# EAGLE design RBPZ_DynamixelMaxim (EAGLE 9.6.2)
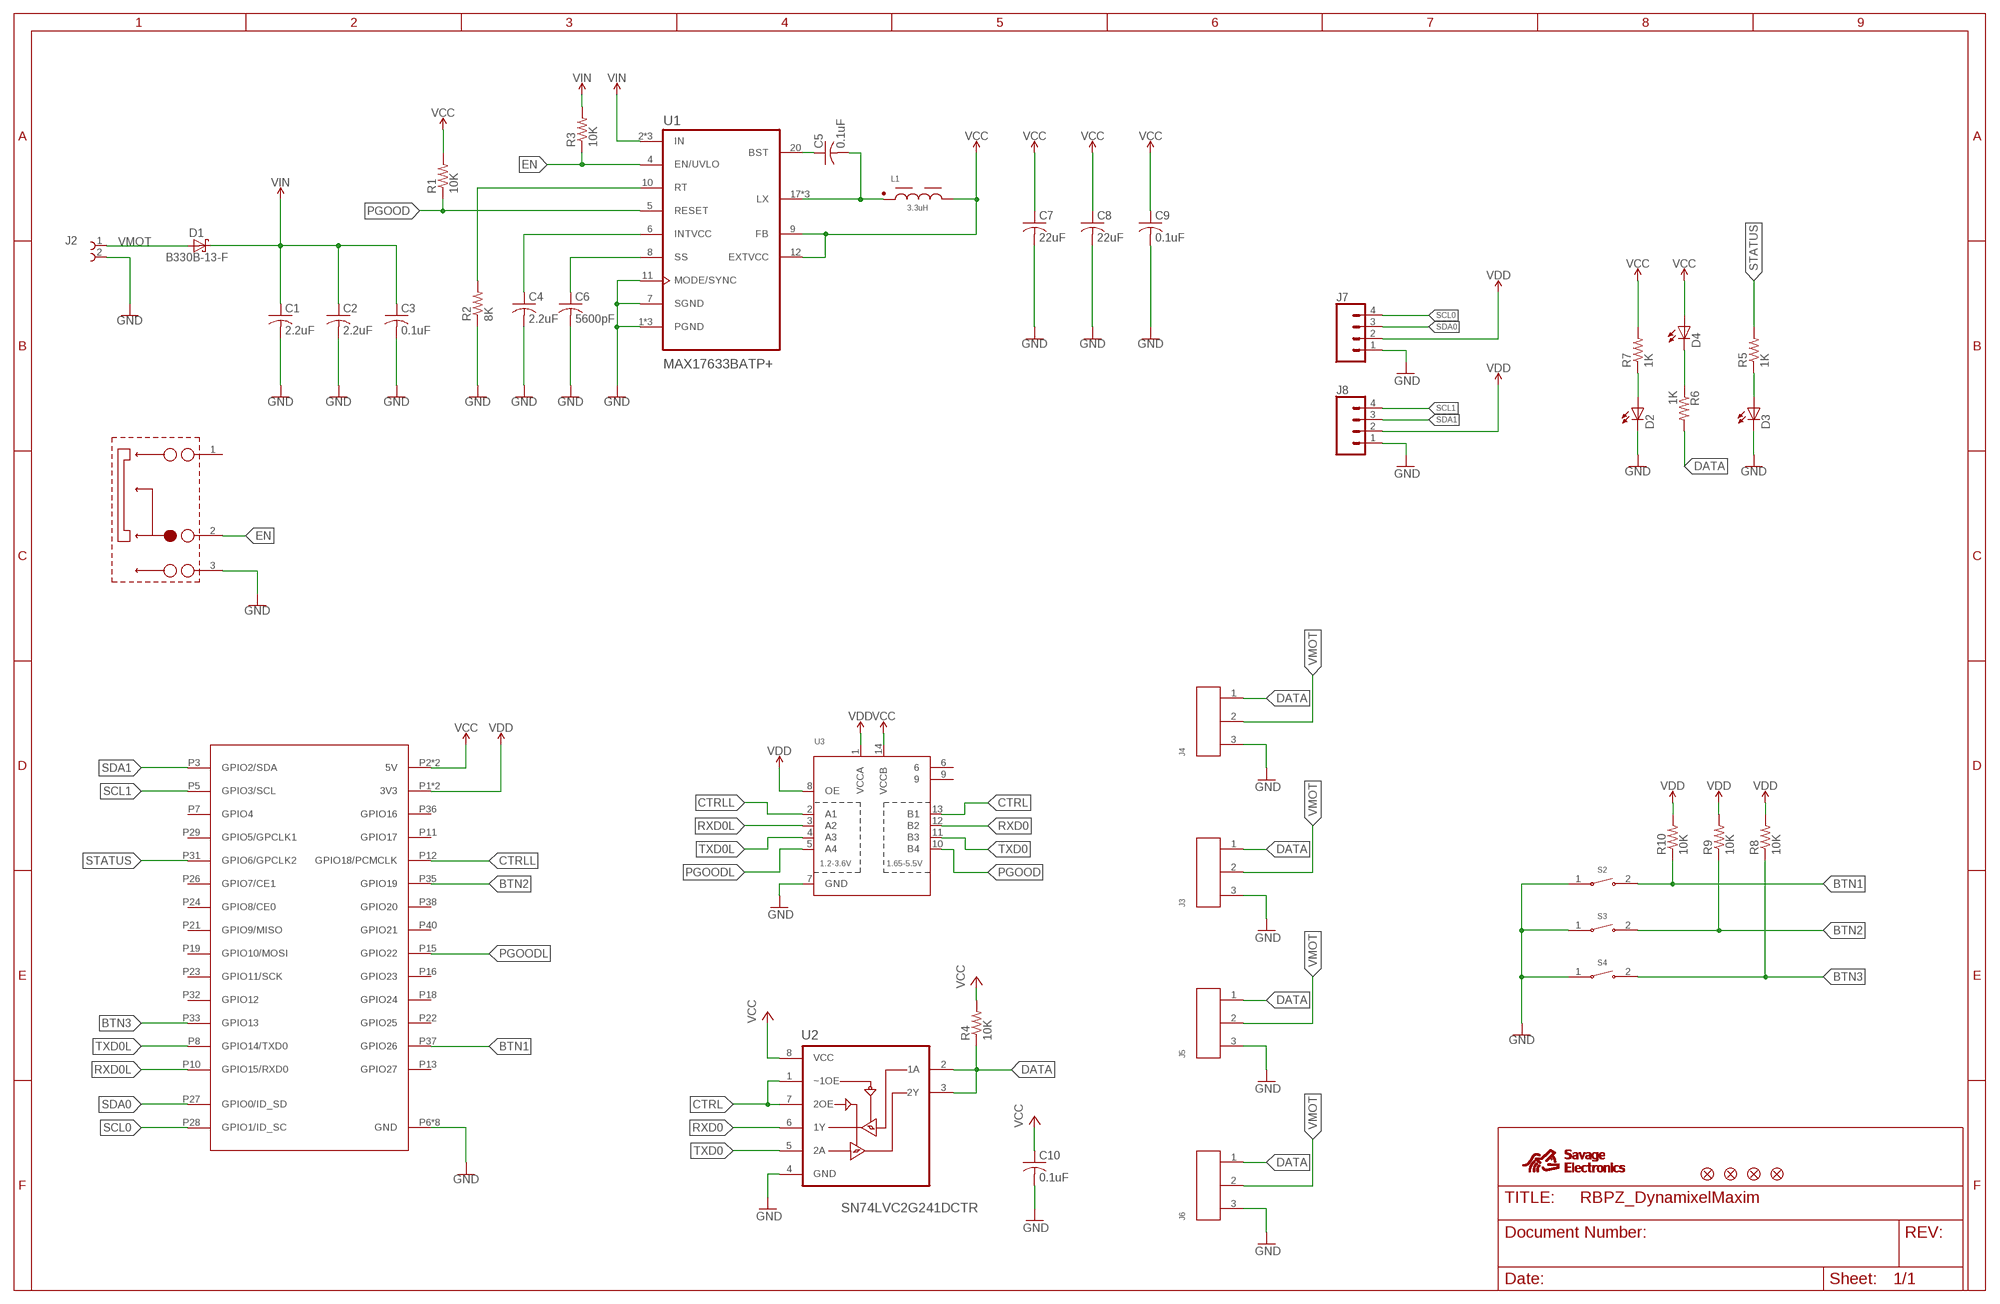
[diagram p0: schematic, sheet 1]

## Parts
C1  2.2uF  C-USC1210  [C1210]
C2  2.2uF  C-USC1210  [C1210]
C3  0.1uF  C-USC0805  [C0805]
C4  2.2uF  C-USC1206  [C1206]
C5  0.1uF  C-USC0603  [C0603]
C6  5600pF  C-USC0805  [C0805]
C7  22uF  C-USC1210  [C1210]
C8  22uF  C-USC1210  [C1210]
C9  0.1uF  C-USC0805  [C0805]
C10  0.1uF  C-USC0603  [C0603]
D1  B330B-13-F  [DIONM4336X250N]
D2  LEDCHIP-LED0805  [CHIP-LED0805]
D3  LEDCHIP-LED0805  [CHIP-LED0805]
D4  LEDCHIP-LED0805  [CHIP-LED0805]
FID1  FIDUCIAL""  [FIDUCIAL_1MM]
FID2  FIDUCIAL""  [FIDUCIAL_1MM]
FID3  FIDUCIAL""  [FIDUCIAL_1MM]
FID4  FIDUCIAL""  [FIDUCIAL_1MM]
J1  RBPZERO  [61004021821_RASPBERRYPIZERO]
J2  691137910002  [691137910002]
J3  64600311622  [64600311622]
J4  64600311622  [64600311622]
J5  64600311622  [64600311622]
J6  64600311622  [64600311622]
J7  CONN_04SMD2  [1X04_1MM_RA]
J8  CONN_04SMD2  [1X04_1MM_RA]
L1  3.3uH  WE-SPC_4828_74408942012  [WE-SPC_48XX]
R1  10K  R-US_R0805  [R0805]
R2  8K  R-US_R0805  [R0805]
R3  10K  R-US_R0805  [R0805]
R4  10K  R-US_R0805  [R0805]
R5  1K  R-US_R0805  [R0805]
R6  1K  R-US_R0805  [R0805]
R7  1K  R-US_R0805  [R0805]
R8  10K  R-US_R0805  [R0805]
R9  10K  R-US_R0805  [R0805]
R10  10K  R-US_R0805  [R0805]
S1  450404015514  [450404015514]
S2  434123025826-2PIN  [434123025826-2PIN]
S3  434123025826-2PIN  [434123025826-2PIN]
S4  434123025826-2PIN  [434123025826-2PIN]
U1  MAX17633BATP+  [QFN50P400X400X80-21N]
U2  SN74LVC2G241DCTR  SN74LVC2G241  [SOP65P400X130-8N]
U3  TXB0104PWR  [TSSOP14]

## Nets
BTN1: J1.P37(GPIO26) R10.1 S2.2
BTN2: J1.P35(GPIO19) R9.1 S3.2
BTN3: J1.P33(GPIO13) R8.1 S4.2
CTRL: U2.1(~1OE) U2.7(2OE) U3.13(B1)
CTRLL: J1.P12(GPIO18/PCMCLK) U3.2(A1)
DATA: J3.1 J4.1 J5.1 J6.1 R4.1 R6.2 U2.2(1A) U2.3(2Y)
EN: R3.1 S1.2 U1.4(EN/UVLO)
GND: C1.2 C2.2 C3.2 C4.2 C6.2 C7.2 C8.2 C9.2 C10.2 D2.C D3.C J1.P6(GND) J1.P9(GND) J1.P14(GND) J1.P20(GND) J1.P25(GND) J1.P30(GND) J1.P34(GND) J1.P39(GND) J2.2 J3.3 J4.3 J5.3 J6.3 J7.1 J8.1 R2.1 S1.3 S2.1 S3.1 S4.1 U1.1(PGND) U1.7(SGND) U1.11(MODE/SYNC) U1.15(PGND) U1.21(PGND) U2.4(GND) U3.7(GND)
N$1: D4.C R6.1
N$2: C6.1 U1.8(SS)
N$3: D2.A R7.1
N$4: C5.2 L1.1 U1.17(LX) U1.18(LX) U1.19(LX)
N$5: D3.A R5.1
N$6: R2.2 U1.10(RT)
N$7: C5.1 U1.20(BST)
N$8: C4.1 U1.6(INTVCC)
PGOOD: R1.1 U1.5(RESET) U3.10(B4)
PGOODL: J1.P15(GPIO22) U3.5(A4)
RXD0: U2.6(1Y) U3.12(B2)
RXD0L: J1.P10(GPIO15/RXD0) U3.3(A2)
SCL0: J1.P28(GPIO1/ID_SC) J7.4
SCL1: J1.P5(GPIO3/SCL) J8.4
SDA0: J1.P27(GPIO0/ID_SD) J7.3
SDA1: J1.P3(GPIO2/SDA) J8.3
STATUS: J1.P31(GPIO6/GPCLK2) R5.2
TXD0: U2.5(2A) U3.11(B3)
TXD0L: J1.P8(GPIO14/TXD0) U3.4(A3)
VCC: C7.1 C8.1 C9.1 C10.1 D4.A J1.P2(5V) J1.P4(5V) L1.2 R1.2 R4.2 R7.2 U1.9(FB) U1.12(EXTVCC) U2.8(VCC) U3.14(VCCB)
VDD: J1.P1(3V3) J1.P17(3V3) J7.2 J8.2 R8.2 R9.2 R10.2 U3.1(VCCA) U3.8(OE)
VIN: C1.1 C2.1 C3.1 D1.1(C) R3.2 U1.2(IN) U1.3(IN) U1.14(IN)
VMOT: D1.2(A) J2.1 J3.2 J4.2 J5.2 J6.2
Unconnected: J1.P7(GPIO4) J1.P11(GPIO17) J1.P13(GPIO27) J1.P16(GPIO23) J1.P18(GPIO24) J1.P19(GPIO10/MOSI) J1.P21(GPIO9/MISO) J1.P22(GPIO25) J1.P23(GPIO11/SCK) J1.P24(GPIO8/CE0) J1.P26(GPIO7/CE1) J1.P29(GPIO5/GPCLK1) J1.P32(GPIO12) J1.P36(GPIO16) J1.P38(GPIO20) J1.P40(GPIO21) S1.1 U3.6 U3.9

## Library data of the parts
C1-C10 = Adafruit:C-US: CAPACITOR, American symbol
D1 = B330B-13-F:B330B-13-F: Schottky Diode
D2-D4 = Adafruit:LED: LED OSRAM: - CHIPLED LG R971, LG N971, LY N971, LG Q971, LY Q971, LO R971, LY R971 LH N974, LH R974 LS Q976, LO Q976, LY Q976 LO Q996 - Hyper CHIPLED LW Q18S LB Q993, LB Q99A, LB R99A - SideLED LS A670, LO A670, LY A670, LG A670, LP A670 LB A673, LV A673, LT A673, LW A673 LH A674 LY A675 LS A676, LA A676, LO A676, LY A676, LW A676 LS A679, LY A679, LG A679 - Hyper Micro SIDELED® LS Y876, LA Y876, LO Y876, LY Y876 LT Y87S - SmartLED LW L88C, LW L88S LB L89C, LB L89S, LG L890 LS L89K, LO L89K, LY L89K LS L896, LA L896, LO L896, LY L896 - TOPLED LS T670, LO T670, LY T670, LG T670, LP T670 LSG T670, LSP T670, LSY T670, LOP T670, LYG T670 LG T671, LOG T671, LSG T671 LB T673, LV T673, LT T673, LW T673 LH T674 LS T676, LA T676, LO T676, LY T676, LB T676, LH T676, LSB T676, LW T676 LB T67C, LV T67C, LT T67C, LS T67K, LO T67K, LY T67K, LW E67C LS E67B, LA E67B, LO E67B, LY E67B, LB E67C, LV E67C, LT E67C LW T67C LS T679, LY T679, LG T679 LS T770, LO T770, LY T770, LG T770, LP T770 LB T773, LV T773, LT T773, LW T773 LH T774 LS E675, LA E675, LY E675, LS T675 LS T776, LA T776, LO T776, LY T776, LB T776 LHGB T686 LT T68C, LB T68C - Hyper Mini TOPLED® LB M676 - Mini TOPLED Santana® LG M470 LS M47K, LO M47K, LY M47K Source: http://www.osram.convergy.de/
FID1-FID4 = microbuilder:FIDUCIAL: Fiducial Alignment Points Various fiducial points for machine vision alignment.; BOM: EXCLUDE
J1 = RaspberryPi:RBPZERO
J2 = TerminalBlocks (rev19b):691137910002: WR-TBL1 SERIE 1379 - 7.50 MM - HORIZONTAL CABLE ENTRY WITH PRESSURE CLAMP - GLOW WIRE PLASTIC - 2 pins <http://katalog.we-online.de/media/thumbs2/eican/thb_Con-TBL_Screw_PressureClamp_6911379100xx_pf2.jpg> Details see: http://katalog.we-online.de/en/em/TBL_7_50_1379_HORIZONTAL_ENTRY_W_PRESSURE_CLAMP_69113791000x Created on 2015-07-09 2015 (C) Wurth Elektronik
J3-J6 = Wire-to-Board (rev18a):64600311622: WR-WTB 2.50mm Male Shrouded Header, 3 Pins=>Code : WR-WTB_Stiftleiste_m.V_64600311622 <http://katalog.we-online.de/media/thumbs2/eican/thb_WR-WTB_Stiftleiste_m.V_64600711622.jpg> Details see: http://katalog.we-online.de/en/em/WTB_2_50_MALE_SHROUDED_HEADER_6460XX11622 Created 2014-06-05, Karrer Zheng 2014 (C) Würth Elektronik
J7 J8 = SparkFun-Connectors:CONN_04: Multi connection point. Often used as Generic Header-pin footprint for 0.1 inch spaced/style header connections On any of the 0.1 inch spaced packages, you can populate with these: Break Away Headers - Straight <https://www.sparkfun.com/products/116> (PRT-00116) Break Away Male Headers - Right Angle <https://www.sparkfun.com/products/553> (PRT-00553) Female Headers <https://www.sparkfun.com/products/115> (PRT-00115) Break Away Headers - Machine Pin <https://www.sparkfun.com/products/117> (PRT-00117) Break Away Female Headers - Swiss Machine Pin <https://www.sparkfun.com/products/743> (PRT-00743) For SCREWTERMINALS and SPRING TERMINALS visit here: Screw Terimnals on SparkFun.com <https://www.sparkfun.com/search/results?term=Screw+Terminals> (5mm/3.5mm/2.54mm spacing) This device is also useful as a general connection point to wire up your design to another part of your project. Our various solder wires solder well into these plated through hole pads. Hook-Up Wire - Assortment (Stranded, 22 AWG) <https://www.sparkfun.com/products/11375> (PRT-11375) Hook-Up Wire - Assortment (Solid Core, 22 AWG) <https://www.sparkfun.com/products/11367> (PRT-11367) View the entire wire category on our website here <https://www.sparkfun.com/categories/141> Special notes: Molex polarized connector foot print use with SKU : PRT-08231 with associated crimp pins and housings. 1MM SMD Version SKU: PRT-10208; PROD_ID: CONN-10310; SF_ID: PRT-10208
L1 = EMCComponents (rev19b):WE-SPC_4828: SMD-Shielded Power Inductor WE-SPC <http://katalog.we-online.de/media/images/v2/Family_WE-SPC.jpg> Details see: http://katalog.we-online.de/en/pbs/WE-SPC? Updated by Dan Xu 2014-07-11 2014 (C) Würth Elektronik; WE-NUMBER: 74408942012/1,2uH
R1-R10 = Adafruit:R-US_: RESISTOR, American symbol
S1 = Eagle_SWITCHES (rev18c):450404015514: WS-SLSU Right angle Slide Switch with boss design Specification Rating 300mA, 12VDC Contact Resistance Initial:70mΩ max. After life test: 200mΩ max. Insulation Resistance: min.100MΩ at 500VDC Dielectric Strength : 250VAC for 1 minute Travel:1.5±0.15mm Operating force :150 ± 75g. Life cycle:10000 steps Switch function : ON-ON. Material Cover : : Stainless Steel Base :PA46 UL 94 HB,COLOR Black Frame :LCP UL 94 V-0, color Black Contact : :Copper Alloy with Silver Terminal : Copper Alloy with Silver <http://katalog.we-online.de/media/images/v2/Family_WS-SLSU_Gruppe.jpg> Details see: http://katalog.we-online.de/en/em/SLSU_6_7X_2_7_SMD_HORIZONTAL 2015 (C) Wurth Elektronik
S2-S4 = Eagle_SWITCHES (rev18c):434123025826-2PIN: 4.2 x 3.2 mm J-Bend SMD Tact Switch WS-TASV MATERIAL PROPERTIES: Cover Material Stainless Steel Actuator Material LCP Actuator Flammability Rating UL94 V-0 Actuator Color White;​ Black Frame Material LCP Frame Flammability Rating UL94 V-0 Frame Color Black Contact Material Stainless Steel Contact Plating Silver Terminal Material Copper Alloy Terminal Plating Silver ELECTRICAL PROPERTIES: Rated Current [1] 50 mA Rated Voltage 16 V (DC) Contact Resistance Initial 500 mΩ Contact Resistance After Life Test 1 Ω Insulation Resistance 100 MΩ Withstanding Voltage 250 V (AC) Bounce 10 ms MECHANICAL PROPERTIES: Operation Force 260 g;​ 160 g Life Cycle 50000 Times;​ 100000 Times GENERAL INFORMATION: Operating Temperature -40 °C up to +85 °C Storage Temperature (in original packaging) -40 °C up to +85 °C PACKAGING PROPERTIES: Packaging Tape and Reel Packaging Unit (Qty.) 2900 <http://katalog.we-online.de/media/images/v2/Family_WS-TASV-4341x30258x6_Gruppe.jpg> Details see: http://katalog.we-online.de/em/datasheet/434123025826.pdf 2017(C) Wurth Elektronik
U1 = SnapEDA Library:MAX17633BATP+: CORTEX M4F 96MHZ ME11; AVAILABILITY: Unavailable; DESCRIPTION: CORTEX M4F 96MHZ ME11; MF: Maxim Integrated; MP: MAX32660GTP+T; PACKAGE: TQFN-20 Maxim; PRICE: None
U2 = SN74LVC2G241:SN74LVC2G241; AVAILABILITY: Unavailable; DESCRIPTION: Dual Buffer/Driver With 3-State Outputs; MF: Texas Instruments; MP: SN74LVC2G241; PACKAGE: VFSOP-8 Texas Instruments; PRICE: None
U3 = Adafruit:TXB0104PWR: 4-Bit Bi-Directional Level Shifter 1.2V-3.6V (VCCA) to 1.65V-5.5V (VCCB) bi-directional level shifter with auto direction sensing. Max data rate - VCCA 1.8V: 20Mbps (50ns), VCCA 3.3V: 100Mbps (10ns) Digikey: 296-21929-1-ND

## Board
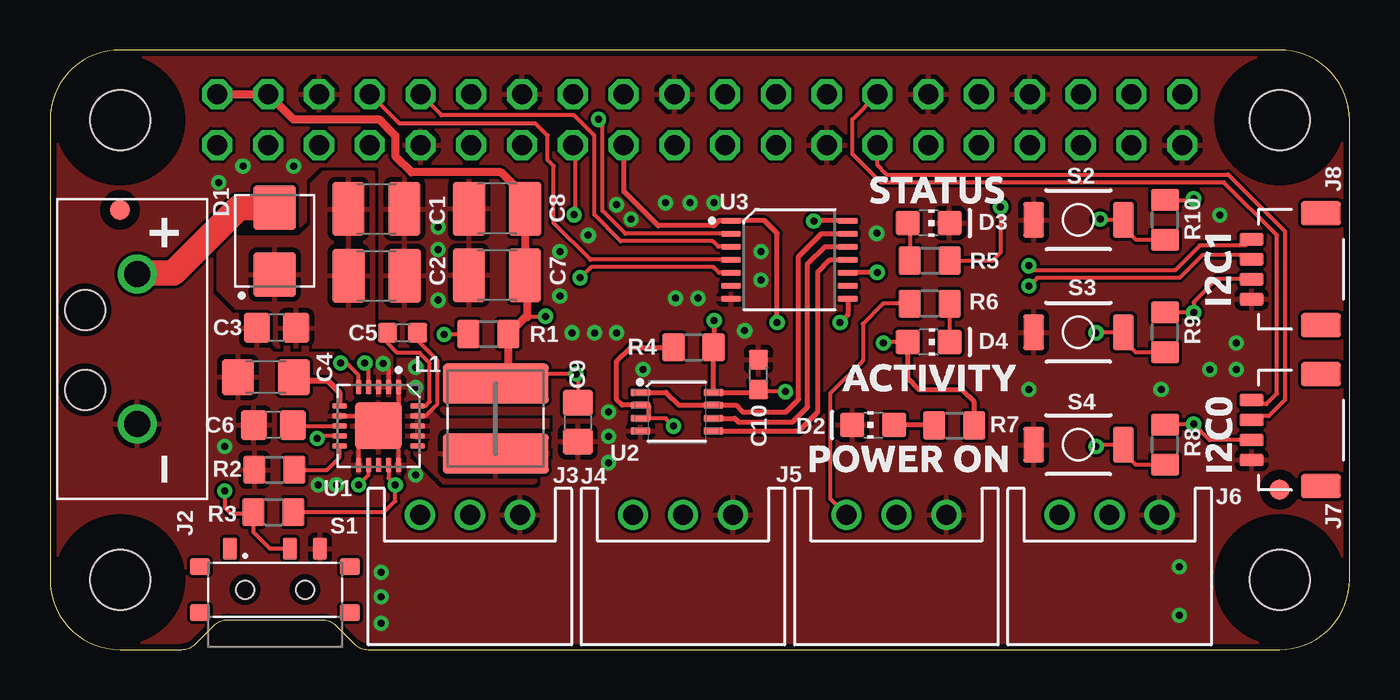
[diagram p1: board, top side]
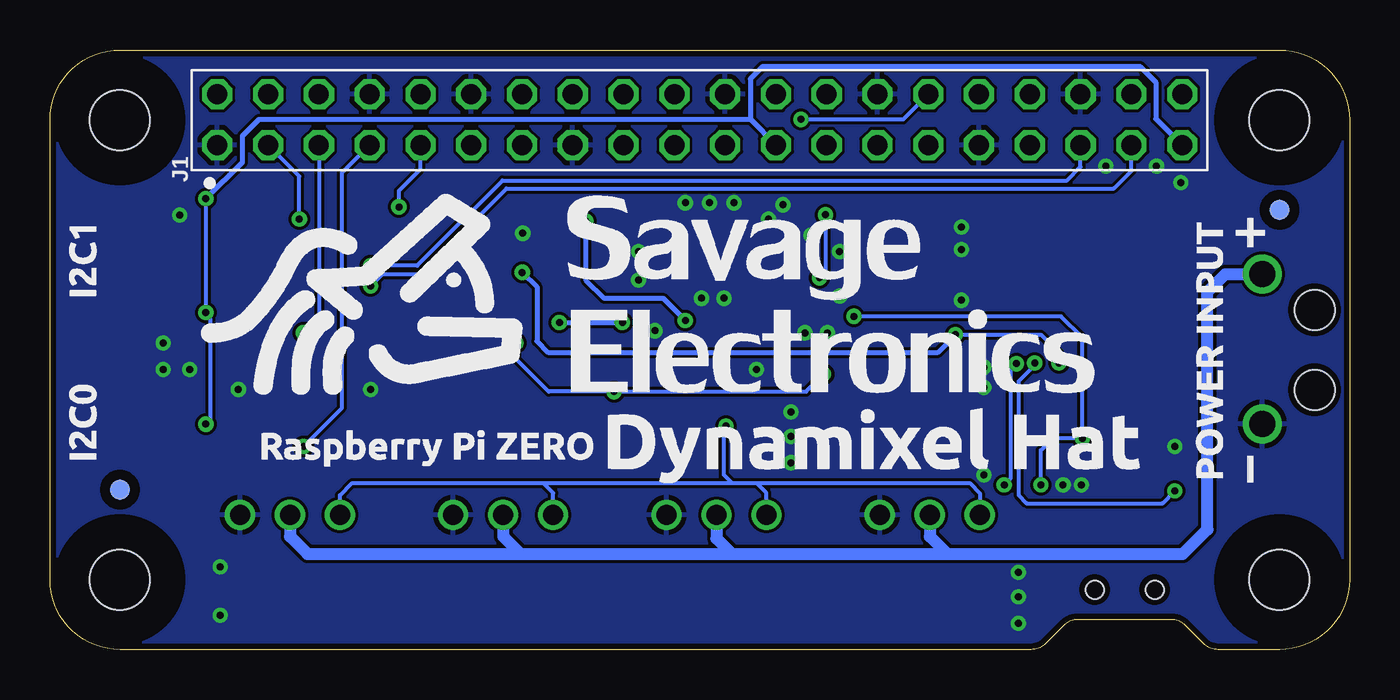
[diagram p2: board, bottom side, seen from below]

Size 65 x 30 mm. Coordinates in mm from the lower left corner, seen from the top.
Outline: 65,26.5 arc90 61.5,30
Outline: 61.5,30 3.5,30 arc90 0,26.5 0,3.5 arc90 3.5,0 6.59,0 arc45 7.29,0.29 8.21,1.21 arc-45 8.91,1.5 13.59,1.5 arc-45 14.29,1.21 15.21,0.29 arc45 15.91,0 61.5,0 arc90 65,3.5 65,26.5
Outline: 65,26.5 arc90 61.5,30
Copper layers (1*16): Top 0.035mm / dielectric 1.5mm / Bottom 0.035mm
Design rules "default *": minimum track width 6mil, minimum drill 0.35mm, track to track 6mil, track to pad 6mil, pad to pad 6mil, via to via 6mil, smd to smd 6mil, copper to edge 12mil, drill to drill 6mil, minimum pad ring 10mil, minimum via ring 8mil, stop-mask expansion 4mil, vias tented up to drill 15mil, thermal gap 10mil
Holes 2 mm at 1.75,13 1.75,17

### Footprints (pad centres in the part's own frame; a part is rotated, then mirrored left to right if it is on the bottom)
C1210 = smd 1.6 x 2.7: 1 -1.4,0; 2 1.4,0
C0805 = smd 1.3 x 1.5: 1 -0.977,0; 2 0.977,0
C1206 = smd 1.6 x 1.8: 1 -1.4,0; 2 1.4,0
C0603 = smd 0.965 x 0.965: 1 -0.748,0; 2 0.748,0
DIONM4336X250N = smd 2.22 x 2.13: 1 -1.68,0; 2 1.68,0
CHIP-LED0805 = smd 1.2 x 1.2: A 0,-1.05; C 0,1.05
FIDUCIAL_1MM = smd 1 x 1: 1 0,0
61004021821_RASPBERRYPIZERO = drill 1 octagon: P1 56.63,25.241; P2 56.63,27.781; P3 54.09,25.241; P4 54.09,27.781; P5 51.55,25.241; P6 51.55,27.781; P7 49.01,25.241; P8 49.01,27.781; P9 46.47,25.241; P10 46.47,27.781; P11 43.93,25.241; P12 43.93,27.781; P13 41.39,25.241; P14 41.39,27.781; P15 38.85,25.241; P16 38.85,27.781; P17 36.31,25.241; P18 36.31,27.781; P19 33.77,25.241; P20 33.77,27.781; P21 31.23,25.241; P22 31.23,27.781; P23 28.69,25.241; P24 28.69,27.781; P25 26.15,25.241; P26 26.15,27.781; P27 23.61,25.241; P28 23.61,27.781; P29 21.07,25.241; P30 21.07,27.781; P31 18.53,25.241; P32 18.53,27.781; P33 15.99,25.241; P34 15.99,27.781; P35 13.45,25.241; P36 13.45,27.781; P37 10.91,25.241; P38 10.91,27.781; P39 8.37,25.241; P40 8.37,27.781 | hole 3: 3.5,26.499; 61.5,26.499; 3.5,3.499; 61.5,3.499
691137910002 = drill 1.3: 1 -3.75,0; 2 3.75,0
64600311622 = drill 1: 1 2.5,0; 2 0,0; 3 -2.5,0
1X04_1MM_RA = smd 0.61 x 1.219: 1 -1.5,0; 2 -0.5,0; 3 0.5,0; 4 1.5,0 | smd 1.2 x 2: NC1 2.8,-3.472; NC2 -2.8,-3.472
WE-SPC_48XX = smd 2 x 5.3: 1 -1.75,0; 2 1.75,0
R0805 = smd 1.1 x 1.4: 1 -1,0; 2 1,0
450404015514 = smd 0.7 x 1.1: 1 2.25,-2.05; 2 -0.75,-2.05; 3 -2.25,-2.05 | smd 1 x 0.8: Z1 -3.75,1.15; Z2 3.75,1.15; Z3 3.75,-1.15; Z4 -3.75,-1.15 | hole 0.9: -1.5,0; 1.5,0
434123025826-2PIN = smd 1.05 x 1.8: 1 -2.24,0; 2 2.24,0
QFN50P400X400X80-21N = smd 0.711 x 0.254: 1 -1.945,1; 2 -1.945,0.5; 3 -1.945,0; 4 -1.945,-0.5; 5 -1.945,-1; 11 1.945,-1; 12 1.945,-0.5; 13 1.945,0; 14 1.945,0.5; 15 1.945,1 | smd 0.254 x 0.711: 6 -1,-1.945; 7 -0.5,-1.945; 8 0,-1.945; 9 0.5,-1.945; 10 1,-1.945; 16 1,1.945; 17 0.5,1.945; 18 0,1.945; 19 -0.5,1.945; 20 -1,1.945 | smd 2.337 x 2.337: 21 0,0
SOP65P400X130-8N = smd 0.965 x 0.356: 1 -1.829,0.965; 2 -1.829,0.33; 3 -1.829,-0.33; 4 -1.829,-0.965; 5 1.829,-0.965; 6 1.829,-0.33; 7 1.829,0.33; 8 1.829,0.965
TSSOP14 = smd 0.305 x 0.991: 1 -1.95,-2.918; 2 -1.3,-2.918; 3 -0.65,-2.918; 4 0,-2.918; 5 0.65,-2.918; 6 1.3,-2.918; 7 1.95,-2.918; 8 1.95,2.918; 9 1.3,2.918; 10 0.65,2.918; 11 0,2.918; 12 -0.65,2.918; 13 -1.3,2.918; 14 -1.95,2.918

### Placement (x,y rotation side)
C1  16.33,22.05 0 top
C2  16.34,18.7 0 top
C3  11.34,16.09 180 top
C4  10.8,13.63 180 top
C5  17.64,15.85 0 top
C6  11.18,11.24 180 top
C7  22.36,18.73 180 top
C8  22.36,22.06 180 top
C9  26.41,11.38 270 top
C10  35.44,13.76 90 top
D1  11.23,20.44 90 top
D2  41.18,11.24 90 top
D3  43.95,21.34 270 top
D4  43.95,15.39 270 top
FID1  61.5,8 180 top
FID2  3.5,22 180 top
FID3  3.5,22 0 bottom
FID4  61.5,8 0 bottom
J1  65,0 0 bottom
J2  4.36,15.04 270 top
J3  21,6.73 180 top
J4  31.67,6.73 180 top
J5  42.33,6.73 180 top
J6  53,6.73 180 top
J7  60.1,10.98 90 top
J8  60.1,19.03 90 top
L1  22.29,11.56 90 top
R1  21.93,15.79 0 top
R2  11.23,8.99 0 top
R3  11.18,6.88 0 top
R4  32.19,15.12 0 top
R5  44.01,19.46 0 top
R6  43.99,17.31 180 top
R7  45.23,11.21 0 top
R8  55.77,10.25 90 top
R9  55.77,15.88 90 top
R10  55.77,21.5 90 top
S1  11.25,3 180 top
S2  51.44,21.5 0 top
S3  51.44,15.88 0 top
S4  51.44,10.25 0 top
U1  16.43,11.19 270 top
U2  31.36,11.9 0 top
U3  36.98,19.51 270 top

### Tracks (layer width: path | path; a pad name or v marks a point on that pad's centre or on a via)
BTN1  (via drill 0.35)
  Top 0.203: R10.1 54.33,20.5 53.68,21.15 S2.2 52.57,21.5 v52.53,21.54
  Bottom 0.203: v52.53,21.54 52.53,23.68 J1.P37
BTN2  (via drill 0.35)
  Top 0.203: R9.1 54.31,14.88 53.68,15.5 S3.2 52.35,15.88 v52.32,15.85
  Bottom 0.203: v52.32,15.85 51.51,16.66 51.51,25.2 J1.P35
BTN3  (via drill 0.35)
  Top 0.203: R8.1 54.31,9.25 53.68,9.87 S4.2 52.41,10.25 v52.32,10.16
  Bottom 0.203: v52.32,10.16 50.39,12.09 50.39,23.86 J1.P33
CTRL
  Top 0.254: U2.1 30.82,12.86 31.46,12.23 U2.7 34.3,12.23 34.65,11.89 36.8,11.89 37.44,12.52 37.44,19.66 38.59,20.81 U3.13
CTRLL  (via drill 0.35)
  Top 0.203: U3.2 28.78,20.81 27.64,21.95 27.64,26.32 v27.43,26.53
  Bottom 0.203: v27.43,26.53 22.32,26.53 J1.P12
DATA  (via drill 0.35)
  Top 0.203: R6.2 41.67,17.31 40.66,16.29 40.66,14.44 39.01,12.8 39.01,7.55 J5.1 | U2.3 30.8,11.57 v31.19,11.18
  Top 0.254: U2.3 29.94,11.57 29.94,12.23 U2.2 28.61,12.23 28.35,12.5 28.35,14.43 29.04,15.12 R4.1
  Bottom 0.203: J6.1 50.5,7.72 49.89,8.33 40.34,8.33 | J3.1 18.49,6.74 18.49,7.82 19,8.33 29.67,8.33 | 40.34,8.33 30.89,8.33 | 30.89,8.33 29.67,8.33 | J4.1 29.17,7.83 29.67,8.33 | J5.1 39.83,7.83 40.34,8.33 | 30.89,8.33 31.29,8.74 31.29,11.07 v31.19,11.18
EN  (via drill 0.35)
  Top 0.203: S1.2 11,5.05 10.18,5.87 R3.1 10.12,6.82 9.04,6.82 8.74,7.12 v8.74,7.93 | U1.4 15.93,14.15 v15.75,14.34
  Bottom 0.203: v15.75,14.34 15.75,14.23 16.56,13.42 16.56,7.73 16.15,7.33 9.35,7.33 v8.74,7.93
GND  (via drill 0.35)
  Top 0.203: U1.15 17.43,10.19 U1.21 16.4,11.23 | U1.7 15.93,11.69 16.4,11.23 | U1.11 15.43,10.26 16.4,11.23 | U1.1 17.43,12.26 16.4,11.23
  other vias: 56.49,4.14 56.49,1.72 35.56,18.49 35.56,19.91 12.19,24.18 9.65,24.18 8.43,23.37 19.41,17.48 19.41,20.02 18.29,13.11 18.29,14.12 18.29,8.74 14.33,8.23 13.41,8.23 8.74,10.16 25.5,17.68 25.5,19.91 27.94,9.35 27.94,10.67 27.94,11.89 32.41,17.58 31.29,17.58 34.75,15.95 33.22,22.35 32,22.35 30.78,22.35 26.92,20.73 28.35,22.25 29.06,21.54 26.11,15.85 27.23,15.85 28.35,15.85 16.56,1.32 16.56,2.64 16.56,3.86 59.33,14.02 59.33,15.34 58.01,14.02 55.58,13 58.52,21.74 48.97,13 41.35,20.83 29.67,14.02 19.41,21.13
  pour Top (rank 2): 0,26.5 0,3.5 arc90 3.5,0 61.5,0 arc90 65,3.5 65,26.5 arc90 61.5,30 3.5,30 arc90
  pour Bottom (rank 2): 0,26.5 0,3.5 arc90 3.5,0 61.5,0 arc90 65,3.5 65,26.5 arc90 61.5,30 3.5,30 arc90
N$1
  Top 0.203: D4.C 45.01,17.29 R6.1
N$2
  Top 0.203: C6.1 12.2,11.19 U1.8
N$3
  Top 0.254: R7.1 44.21,11.24 D2.A
N$4
  Top 0.203: C5.2 18.39,15.46 19.36,14.49 19.36,12.25 18.8,11.69 U1.19 | U1.19
  pour Top: 17.78,12.1 18.9,12.1 19.51,11.49 24.89,11.49 24.89,9.05 24.18,8.34 19.71,8.34 17.78,10.27
N$5
  Top 0.203: D3.A 43.01,21.23 R5.1
N$6
  Top 0.203: R2.2 13.86,8.99 14.49,9.62 U1.10
N$7
  Top 0.203: U1.20 18.79,12.19 19,12.41 19,14.34 18.49,14.84 17.37,14.84 16.89,15.33 C5.1
N$8
  Top 0.305: U1.6 14.49,12.85 13.91,13.43 12.4,13.43 C4.1
PGOOD  (via drill 0.35)
  Top 0.203: v41.38,18.87 41.36,18.86 | U1.5 15.43,13.74 14.83,14.34 v14.53,14.34 | v19.71,15.76 19.74,15.79 R1.1
  Top 0.254: 41.36,18.86 U3.10
  Bottom 0.203: v19.71,15.76 15.44,15.76 14.53,14.84 v14.53,14.34
  Bottom 0.254: v41.38,18.87 41.35,18.87 40.64,18.16 40.64,15.43 40.06,14.84 20.62,14.84 v19.71,15.76
PGOODL  (via drill 0.35)
  Top 0.203: U3.5 33.45,18.86 33.18,19.14 27.05,19.14 v26.52,18.6 | v26.21,21.75 26.25,21.79 26.25,25.14 J1.P15
  Bottom 0.203: v26.52,18.6 26.21,18.91 v26.21,21.75
RXD0
  Top 0.254: U2.6 34.25,11.57 34.44,11.38 37.13,11.38 37.9,12.14 37.9,19.3 38.75,20.16 U3.12
RXD0L
  Top 0.203: U3.3 33.43,20.16 33.15,20.44 28.54,20.44 27.23,21.75 27.23,25.71 26.21,26.73 19.58,26.73 J1.P10
SCL0
  Top 0.203: J7.4 60.3,12.28 60.84,12.28 61.37,12.8 61.37,20.73 58.73,23.37 41.55,23.37 40.13,24.79 40.13,26.52 J1.P28
SCL1  (via drill 0.35)
  Top 0.203: v48.97,19.2 49.17,19 56.29,19 57.51,20.22 59.8,20.22 J8.4
  Bottom 0.203: v48.97,19.2 46.63,19.2 42.37,23.47 14.13,23.47 13.45,24.15 J1.P5
SDA0
  Top 0.203: J7.3 60.3,11.69 60.96,11.69 61.77,12.5 61.77,20.93 58.93,23.77 41.84,23.77 41.39,24.23 J1.P27
SDA1  (via drill 0.35)
  Top 0.203: J8.3 59.9,19.73 57.63,19.73 56.49,18.59 49.38,18.59 v48.97,18.19
  Bottom 0.203: v48.97,18.19 48.36,18.8 46.43,18.8 42.16,23.06 11.79,23.06 10.91,23.95 J1.P3
STATUS  (via drill 0.35)
  Top 0.203: v47.55,22.15 47.55,19.87 47.14,19.46 R5.2
  Bottom 0.203: v47.55,22.15 47.55,22.96 46.49,24.02 46.49,25.22 J1.P31
TXD0
  Top 0.254: U2.5 37.45,10.93 38.41,11.89 38.41,18.9 39.01,19.51 U3.11
TXD0L
  Top 0.203: U3.4 27.04,19.51 25.2,21.35 25.2,24.19 24.89,24.49 24.89,25.71 24.28,26.32 17.48,26.32 16.02,27.78 J1.P8
VCC  (via drill 0.35)
  Top 0.203: v36.78,12.9 35.45,12.9 C10.1 | D4.A 41.99,15.39 41.95,15.34 v41.68,15.34 | U1.9 14.48,10.68 13.49,10.68 v13.37,10.56 | v15.44,8.24 15.93,8.73 U1.12 | C9.1 26.41,13.68 v26.3,13.78 24.68,13.78 24.17,13.27 L1.2 | v24.79,16.67 24.75,16.63 23.88,16.63
  Top 0.254: C10.1 35.39,12.86 U2.8 R4.2 33.22,15.16 v33.22,16.46 | U3.14 38.22,21.46 v38.2,21.44 | R7.2 46.23,12.38 45.62,13 43.48,13 42.91,13.58 D4.A
  Top 0.406: J1.P2 J1.P4 12.17,26.53 12.19,26.53 16.46,26.53 17.27,25.71 17.27,24.7 18.09,23.89 22.55,23.89 23.76,22.68 C8.1 C7.1 23.88,18.61 23.88,16.73 | L1.2 22.93,13.91 R1.2 23.88,16.73 | 23.88,16.63 23.88,16.73
  Bottom 0.203: v41.68,15.34 41.68,14.53 40.05,12.9 v36.78,12.9 27.18,12.9 v26.3,13.78 | v15.44,8.24 15.44,9.97 14.85,10.56 v13.37,10.56 13.37,15.61 14.43,16.67 v24.79,16.67
  Bottom 0.254: v38.2,21.44 38.2,18.49 37.29,17.58 34.34,17.58 v33.22,16.46
VDD  (via drill 0.35)
  Top 0.203: R8.2 55.8,11.28 v57.2,11.28 58,10.48 J7.2 | R9.2 55.78,16.87 v57.2,16.87 57.2,17.38 58.34,18.53 J8.2 | R10.2 57.15,22.5 v57.2,22.55
  Top 0.254: U3.8 39.9,16.74 v39.52,16.37 v39.52,16.36 | v36.37,16.36 36.37,20.83 35.74,21.46 U3.1 33.45,21.46 33.2,21.2 30.42,21.2 28.69,22.93 J1.P17
  Bottom 0.203: v57.2,11.28 57,11.48 57,16.56 57.2,16.76 v57.2,16.87 v57.2,22.55
  Bottom 0.254: v39.52,16.36 v36.37,16.36 | v57.2,22.55 55.37,24.38 55.37,25.7 54.55,26.53 29.97,26.53 | 29.97,26.53 J1.P17 | 29.97,26.53 29.97,28.56 29.36,29.17 10.47,29.17 9.69,28.39 9.69,26.56 J1.P1
VIN  (via drill 0.35)
  Top 0.203: U1.14 16.93,8.58 v17.27,8.24 17.27,7.43 16.73,6.88 R3.2 | v16.66,14.3 16.93,14.03 U1.2
  Bottom 0.203: v17.27,8.24 16.97,8.54 16.97,14 v16.66,14.3
  pour Top: 8.43,20.63 12.5,20.63 13.11,21.24 13.11,23.28 13.72,23.89 16.15,23.89 16.15,15.76 17.07,14.84 17.07,12.71 16.05,12.71 16.05,13.62 14.53,15.15 11.38,15.15 10.97,15.55 10.97,17.08 9.35,17.08 8.43,17.99
VMOT
  Top 1.27: D1.2 9.44,22.12 6.17,18.85 4.42,18.85 J2.1
  Bottom 0.61: J3.2 21,5.66 20.12,4.77 | J6.2 53,5.65 52.12,4.77 41.45,4.77 | 41.45,4.77 30.89,4.77 | 30.89,4.77 20.12,4.77 | J4.2 31.67,5.55 30.89,4.77 | J5.2 42.33,5.66 41.45,4.77 | 20.12,4.77 8.34,4.77 7.11,6 7.11,17.89 6.22,18.79 J2.1